# EAGLE design dual_H-bridge (EAGLE 5.11)
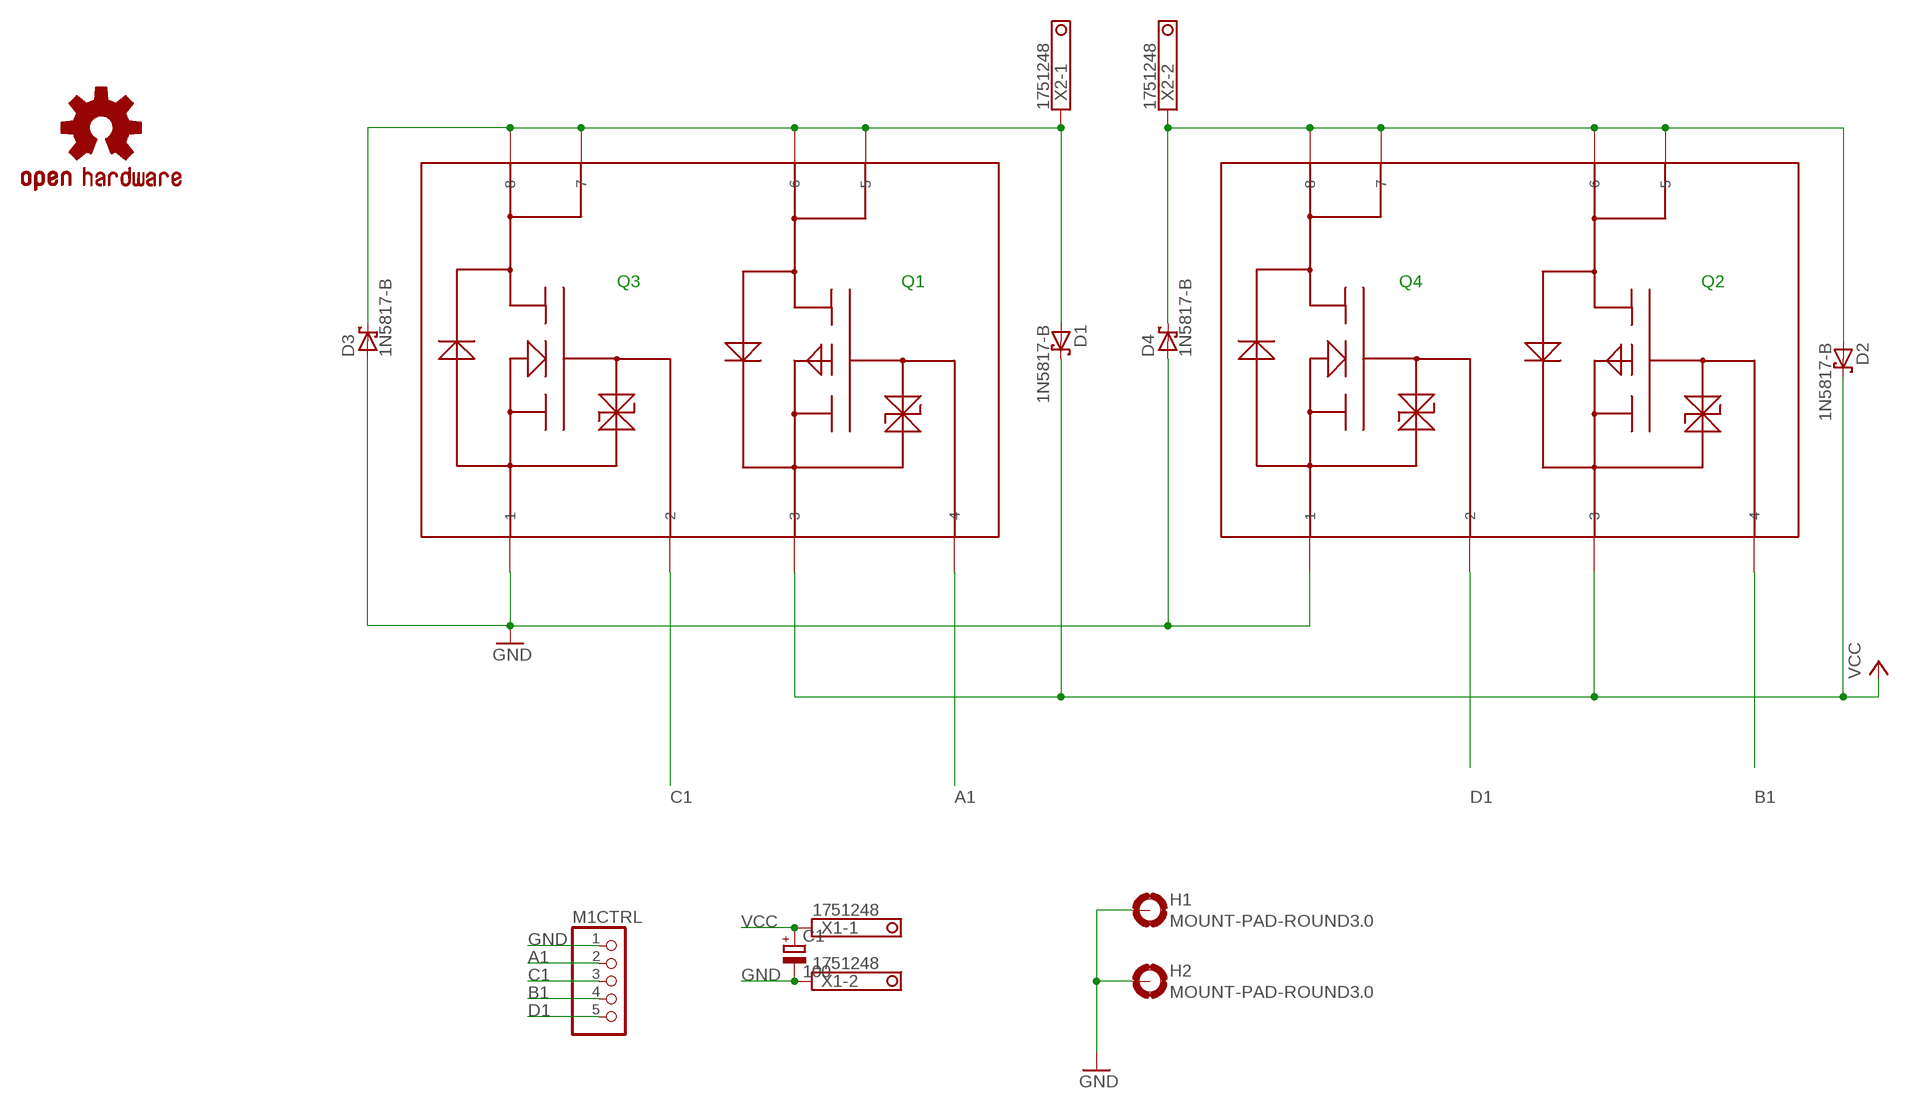
[diagram p0: schematic, sheet 1]

## Parts
C1  100  CPOL-EUE2.5-6  [E2,5-6]
D1  1N5817-B  [DO41-7.6]
D2  1N5817-B  [DO41-7.6]
D3  1N5817-B  [DO41-7.6]
D4  1N5817-B  [DO41-7.6]
H1  MOUNT-PAD-ROUND3.0  [3,0-PAD]
H2  MOUNT-PAD-ROUND3.0  [3,0-PAD]
M1CTRL  PINHD-1X5/90  [1X05/90]
U$1  SP8M3  [SOP8]
U$2  OSHW-LOGOS  [OSHW-LOGO-S]
U$3  SP8M3  [SOP8]
X1  1751248  [1751248]
X2  1751248  [1751248]

## Nets
A1: M1CTRL.2 U$1.4
B1: M1CTRL.4 U$3.4
C1: M1CTRL.3 U$1.2
D1: M1CTRL.5 U$3.2
GND: C1.- D3.A D4.A H1.B3,0(MOUNT) H2.B3,0(MOUNT) M1CTRL.1 U$1.1 U$3.1 X1.2
N$5: D1.A D3.C U$1.5 U$1.6 U$1.7 U$1.8 X2.1
N$6: D2.A D4.C U$3.5 U$3.6 U$3.7 U$3.8 X2.2
VCC: C1.+ D1.C D2.C U$1.3 U$3.3 X1.1

## Notes on the sheet
- Q3 | Q1 | Q4 | Q2

## Library data of the parts
C1 = rcl:CPOL-EU: POLARIZED CAPACITOR, European symbol
D1-D4 = diode:1N581*: 1.0A SCHOTTKY BARRIER RECTIFIER Source: http://www.diodes.com/datasheets/ds23001.pdf
H1 H2 = holes:MOUNT-PAD-ROUND: MOUNTING PAD, round
M1CTRL = pinhead:PINHD-1X5: PIN HEADER
U$1 U$3 = smok:SP8M3: Two MOSFETs in 8-pin package (N and P type)
U$2 = SparkFun:OSHW-LOGO: Open Source Hardware Logo This logo indicates the piece of hardware it is found on incorporates a OSHW license and/or adheres to the definition of open source hardware found here: http://freedomdefined.org/OSHW
X1 X2 = con-phoenix-350:1751248: MKDS 1/ 2-3,5 Printklemme Nennstrom: 10 A Bemessungsspannung: 160 V Raster: 3,5 mm Polzahl: 2 Montageart: Löten Anschlussart: Schraubanschluss Anschlussrichtung vom Leiter zur Platine: 0° Source: http://eshop.phoenixcontact.com .. 1751248.pdf; OC_FARNELL: unknown; OC_NEWARK: unknown

## Board
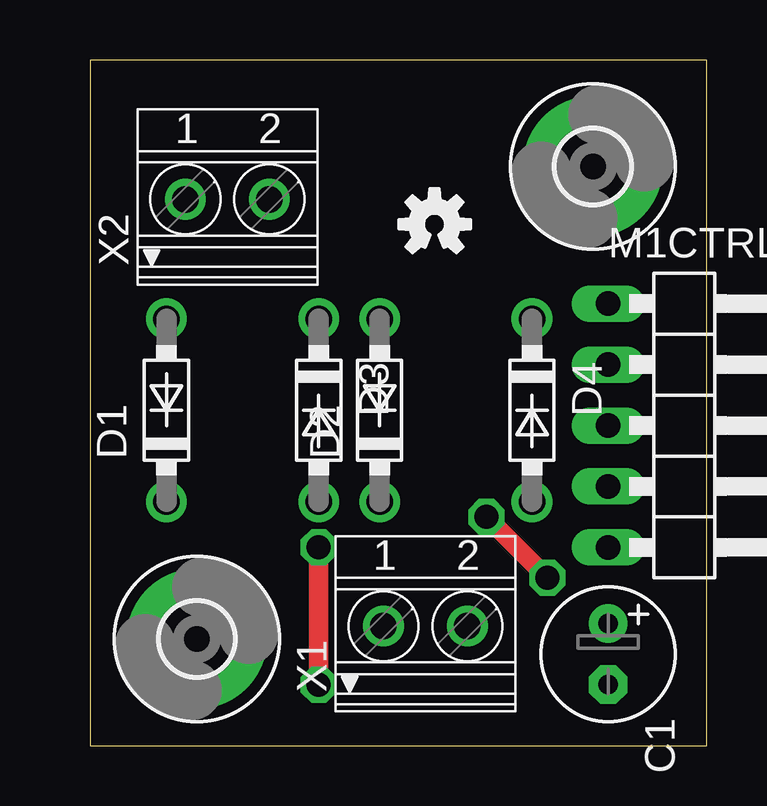
[diagram p1: board, top side]
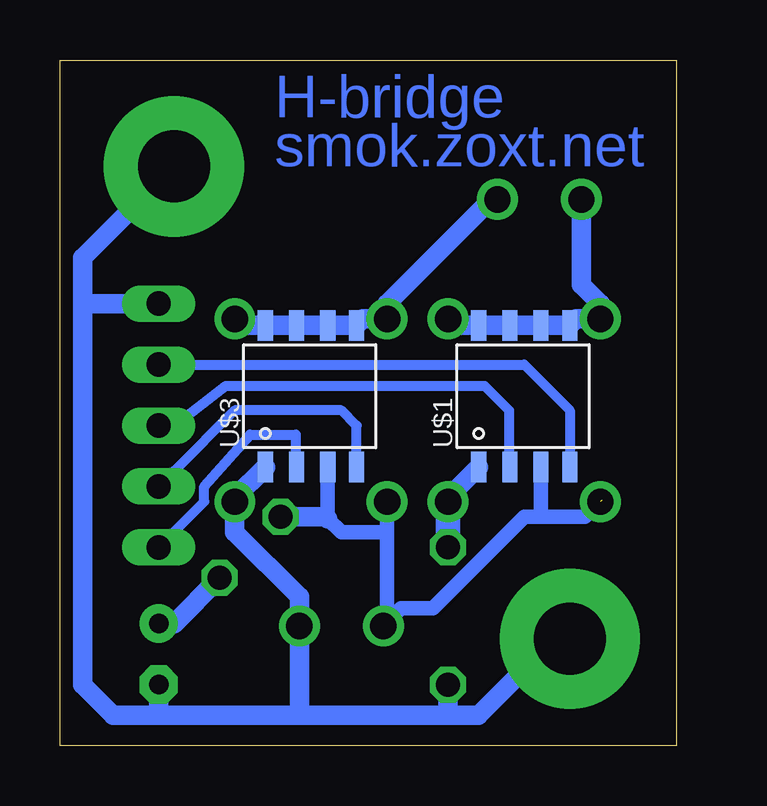
[diagram p2: board, bottom side, seen from below]

Size 25.7 x 28.57 mm. Coordinates in mm from the lower left corner, seen from the top.
Outline: 0,0 25.7,0 25.7,28.57 0,28.57 0,0
Copper layers (1*16): Top 0.035mm / dielectric 1.5mm / Bottom 0.035mm
Design rules "default": minimum track width 10mil, minimum drill 24mil, track to track 8mil, track to pad 8mil, pad to pad 8mil, via to via 8mil, smd to smd 8mil, copper to edge 40mil, drill to drill 8mil, minimum pad ring 10mil, minimum via ring 8mil, stop-mask expansion 4mil, vias tented up to drill 0mil, thermal gap 10mil

### Footprints (pad centres in the part's own frame; a part is rotated, then mirrored left to right if it is on the bottom)
E2,5-6 = drill 0.813 pad 1.6 round: + -1.27,0 | drill 0.813 pad 1.6 octagon: - 1.27,0
DO41-7.6 = drill 1.1 pad 1.7 round: A 3.81,0; C -3.81,0
3,0-PAD = drill 3 pad 5.842 round: B3,0 0,0
1X05/90 = drill 1.016 long: 1 -5.08,-3.81; 2 -2.54,-3.81; 3 0,-3.81; 4 2.54,-3.81; 5 5.08,-3.81
SOP8 = smd 0.635 x 1.27: 1 -1.9,-3; 2 -0.6,-3; 3 0.7,-3; 4 1.9,-3; 5 1.9,2.9; 6 0.7,2.9; 7 -0.6,2.9; 8 -1.9,2.9
1751248 = drill 1.1 pad 1.7 round: 1 -1.75,-0.1; 2 1.75,-0.1

### Placement (x,y rotation side)
C1  21.59,3.81 270 top
D1  3.17,13.97 90 top
D2  12.06,13.97 90 top
D3  9.53,13.97 270 top
D4  18.41,13.97 270 top
H1  4.45,4.45 0 top
H2  20.95,24.13 180 top
M1CTRL  25.4,13.34 270 top
U$1  6.35,14.61 0 bottom
U$2  14.35,21.72 0 top
U$3  15.24,14.61 0 bottom
X1  13.97,5.08 0 top
X2  5.71,22.86 0 top

### Tracks (layer width: path | path; a pad name or v marks a point on that pad's centre or on a via)
A1
  Bottom 0.406: M1CTRL.2 6.35,15.88 4.45,13.97 U$1.4
B1
  Bottom 0.406: M1CTRL.4 20.95,10.79 20.95,11.43 18.41,13.97 13.97,13.97 13.34,13.34 U$3.4
C1
  Bottom 0.406: M1CTRL.3 20.95,13.34 18.8,14.99 8,14.99 6.99,13.97 6.99,11.64 U$1.2
D1
  Bottom 0.406: M1CTRL.5 19.68,10.16 19.68,10.79 17.78,12.95 15.88,12.95 15.88,11.64 U$3.2
GND  (via drill 1 pad 1.02)
  Top 0.813: v9.53,2.54 v9.53,8.26
  Bottom 0.813: H1.B3,0 5.08,4.45 8.26,1.27 9.53,1.27 | 9.53,1.27 15.88,1.27 | 15.88,1.27 21.59,1.27 | 21.59,1.27 23.5,1.27 24.77,2.54 24.77,18.41 | 24.77,18.41 24.77,20.32 H2.B3,0 | 21.59,1.27 C1.- | 15.88,1.27 15.72,1.43 X1.2 15.72,6.2 18.41,8.89 D4.A 18.41,10.33 U$3.1 | D3.A 9.53,10.33 U$1.1 | 9.53,1.27 v9.53,2.54 | 24.77,18.41 M1CTRL.1
  Bottom 1.016: v9.53,8.26 D3.A
N$5
  Bottom 0.813: D3.C 9.25,17.5 U$1.8 U$1.7 U$1.6 U$1.5 4.17,17.78 D1.A 3.17,18.41 3.96,19.2 X2.1
N$6
  Bottom 0.813: D4.C 18.14,17.5 U$3.8 U$3.7 U$3.6 U$3.5 13.06,17.78 D2.A 12.06,18.41 7.72,22.76 X2.2
VCC  (via drill 1 pad 1.02)  (1 unrouted)
  Top 0.813: v16.51,9.53 v19.05,6.99
  Bottom 0.61: 3.11,10.22 3.81,9.53 5.71,9.53 | 5.71,9.53 6.35,9.53 10.16,5.71 11.48,5.71 X1.1 12.06,5.13 12.06,8.89 | U$1.3 5.65,9.59 5.71,9.53 | 12.06,8.89 D2.C | U$3.3 14.54,9.46 13.97,8.89 12.06,8.89
  Bottom 0.813: C1.+ 20.95,5.08 v19.05,6.99 | v16.51,9.53 14.61,9.53 14.54,9.46

### Text on the board
Bottom: H-bridge | smok.zoxt.net